# Altium schematic sheet controllers.SchDoc: FHGR_A3_landscape
size A3; Date: 18.07.2017; DrawnBy: G.P. Catregn; Organization: HTW Chur; Address1: Pulvermühlestrasse 57; Address2: 7004 Chur; Address3: Switzerland; DocumentNumber: 1; Revision: V1.0; SheetNumber: 1; SheetTotal: 3; DocumentName: HTW Template
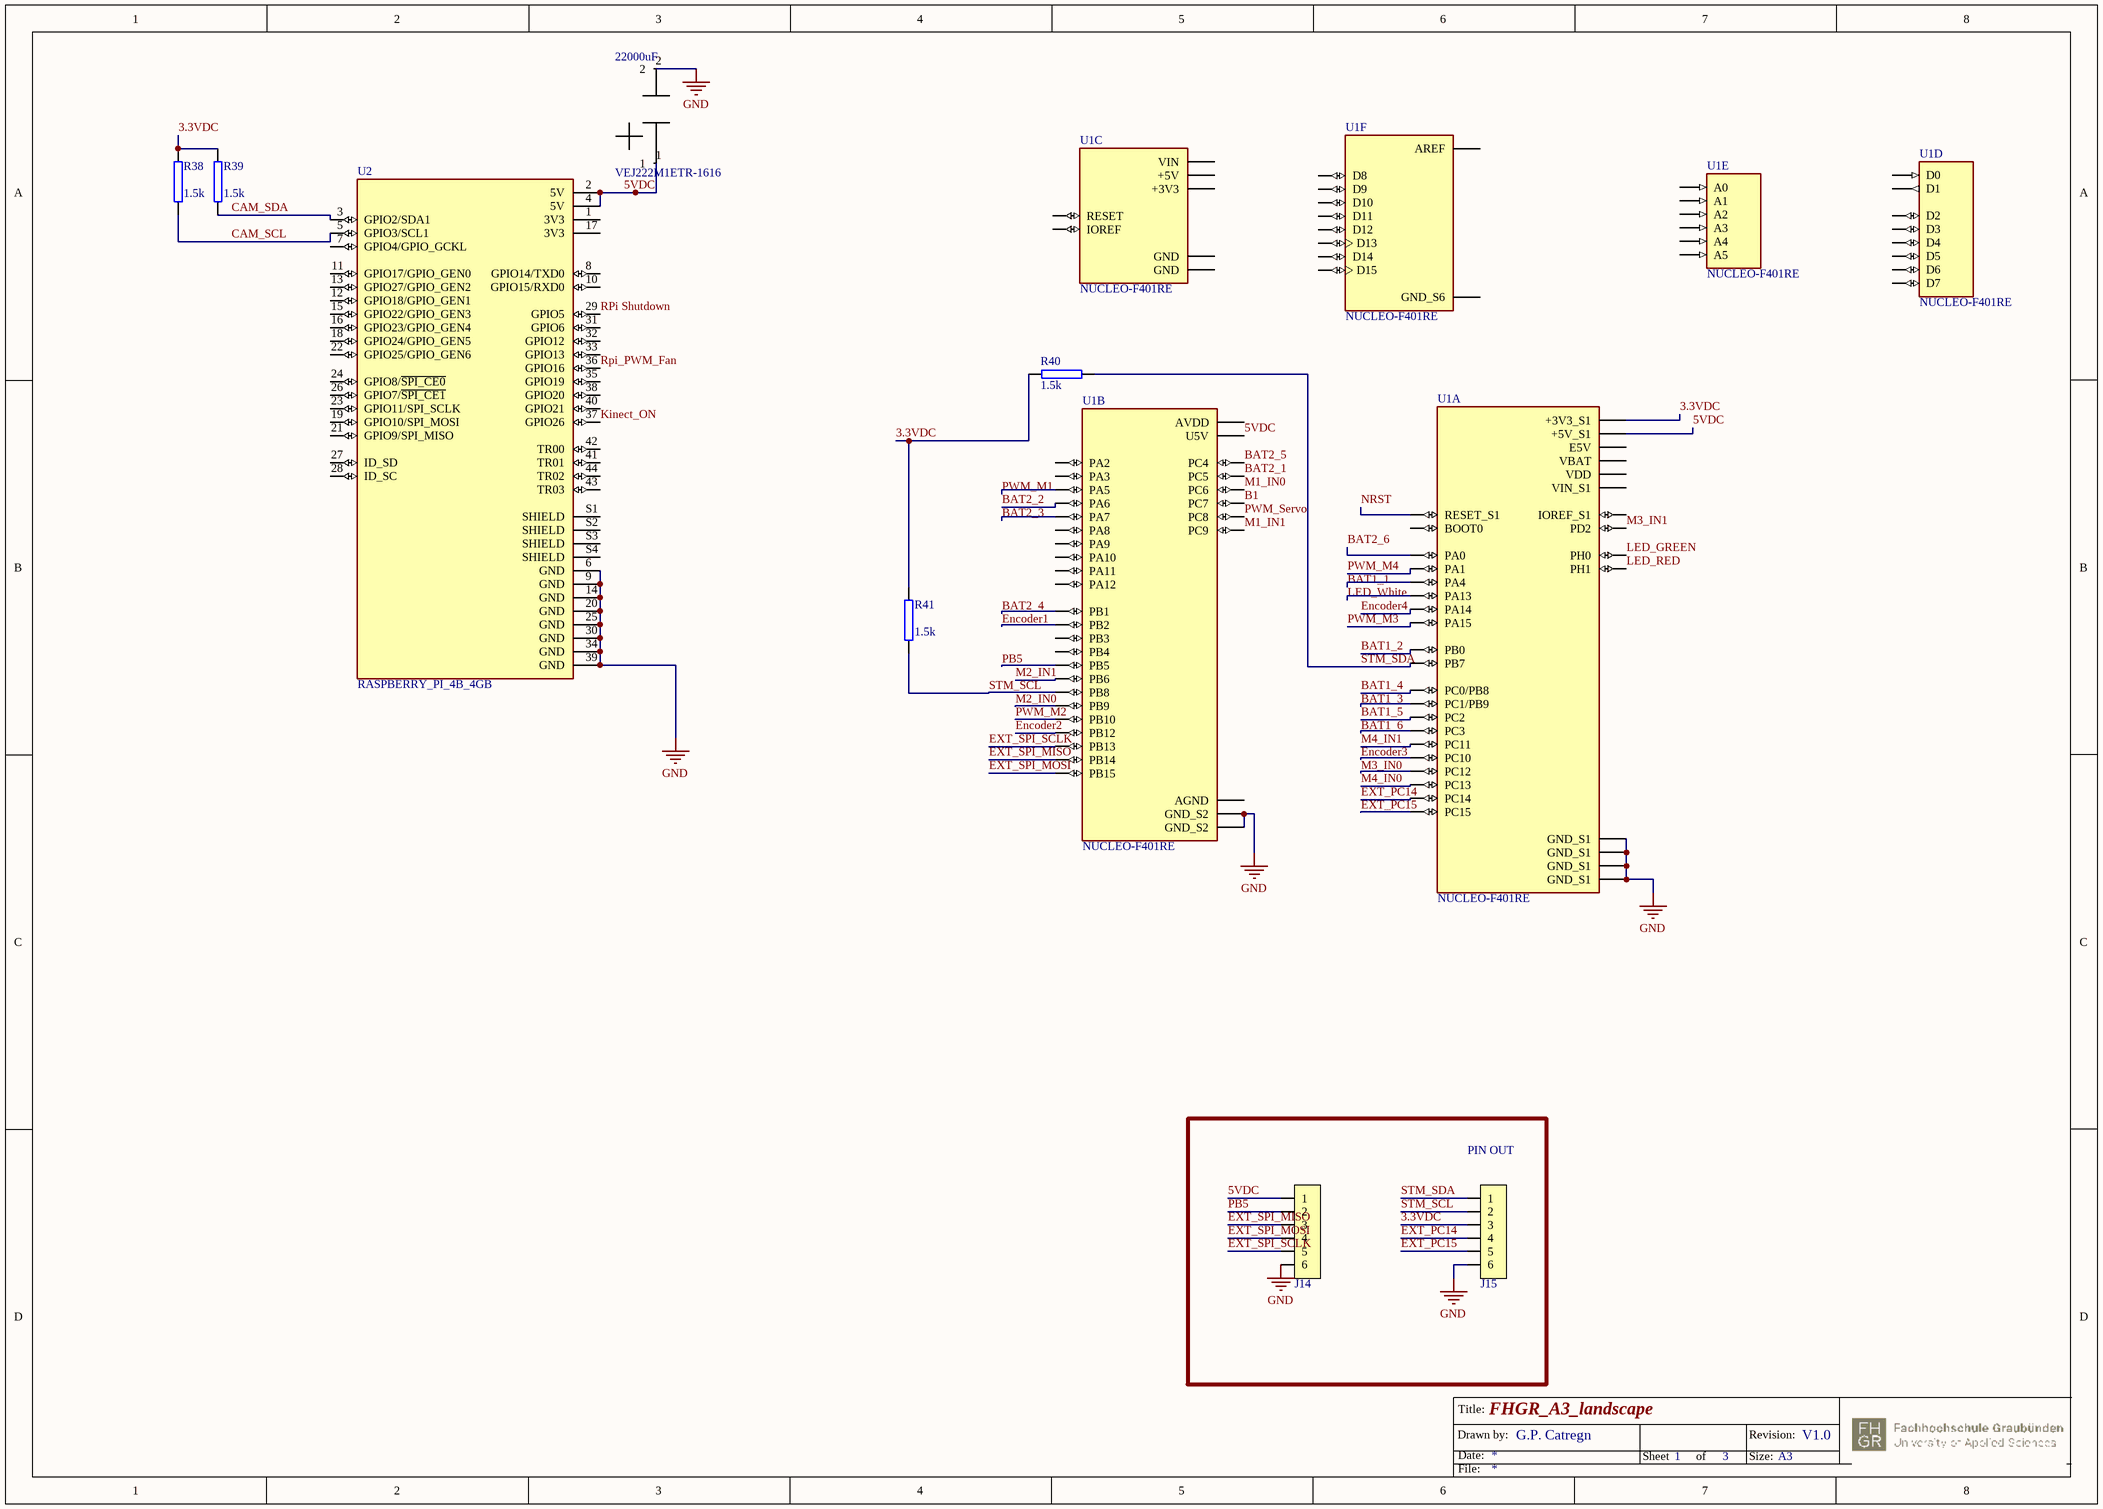
[diagram p0: controllers.SchDoc]

## Parts
22000uF  VEJ222M1ETR-1616  [CAPAE180170X170M]
J14  6Pin_Male  [Header1x6_254]  (value not drawn)
J15  6Pin_Male  [Header1x6_254]  (value not drawn)
R38  value 1.5k  [0805]  (hidden comment: R 1K5 0805)
R39  value 1.5k  [0805]  (hidden comment: R 1K5 0805)
R40  value 1.5k  [0805]  (hidden comment: R 1K5 0805)
R41  value 1.5k  [0805]  (hidden comment: R 1K5 0805)
U1  NUCLEO-F401RE  [ST_NUCLEO-F401RE]  (parts A,B,C,D,E,F of 6)
U2  RASPBERRY_PI_4B_4GB  [MODULE_RASPBERRY_PI_4B_4GB]

## Blocks framed on the sheet
PIN OUT: J14 J15

## Nets
GND: 22000uF.2 J14.6 J15.6 U1.CN7_8(GND_S1) U1.CN7_19(GND_S1) U1.CN7_20(GND_S1) U1.CN7_22(GND_S1) U1.CN10_9(GND_S2) U1.CN10_20(GND_S2) U2.6(GND) U2.9(GND) U2.14(GND) U2.20(GND) U2.25(GND) U2.30(GND) U2.34(GND) U2.39(GND)
3.3VDC: J15.3 R38.2 R39.2 R40.2 R41.2 U1.CN7_16(+3V3_S1)
5VDC: 22000uF.1 J14.1 U1.CN7_18(+5V_S1) U1.CN10_8(U5V) U2.2(5V) U2.4(5V)
B1: U1.CN10_19(PC7)
BAT1_1: U1.CN7_32(PA4)
BAT1_2: U1.CN7_34(PB0)
BAT1_3: U1.CN7_36(PC1/PB9)
BAT1_4: U1.CN7_38(PC0/PB8)
BAT1_5: U1.CN7_35(PC2)
BAT1_6: U1.CN7_37(PC3)
BAT2_1: U1.CN10_6(PC5)
BAT2_2: U1.CN10_13(PA6)
BAT2_3: U1.CN10_15(PA7)
BAT2_4: U1.CN10_24(PB1)
BAT2_5: U1.CN10_34(PC4)
BAT2_6: U1.CN7_28(PA0)
CAM_SCL: R38.1 U2.5(GPIO3/SCL1)
CAM_SDA: R39.1 U2.3(GPIO2/SDA1)
Encoder1: U1.CN10_22(PB2)
Encoder2: U1.CN10_16(PB12)
Encoder3: U1.CN7_1(PC10)
Encoder4: U1.CN7_15(PA14)
EXT_PC14: J15.4 U1.CN7_25(PC14)
EXT_PC15: J15.5 U1.CN7_27(PC15)
EXT_SPI_MISO: J14.3 U1.CN10_28(PB14)
EXT_SPI_MOSI: J14.4 U1.CN10_26(PB15)
EXT_SPI_SCLK: J14.5 U1.CN10_30(PB13)
Kinect_ON: U2.37(GPIO26)
LED_GREEN: U1.CN7_29(PH0)
LED_RED: U1.CN7_31(PH1)
LED_White: U1.CN7_13(PA13)
M1_IN0: U1.CN10_4(PC6)
M1_IN1: U1.CN10_1(PC9)
M2_IN0: U1.CN10_5(PB9)
M2_IN1: U1.CN10_17(PB6)
M3_IN0: U1.CN7_3(PC12)
M3_IN1: U1.CN7_4(PD2)
M4_IN0: U1.CN7_23(PC13)
M4_IN1: U1.CN7_2(PC11)
NRST: U1.CN7_14(RESET_S1)
PB5: J14.2 U1.CN10_29(PB5)
PWM_M1: U1.CN10_11(PA5)
PWM_M2: U1.CN10_25(PB10)
PWM_M3: U1.CN7_17(PA15)
PWM_M4: U1.CN7_30(PA1)
PWM_Servo: U1.CN10_2(PC8)
RPi Shutdown: U2.29(GPIO5)
Rpi_PWM_Fan: U2.36(GPIO16)
STM_SCL: J15.2 R41.1 U1.CN10_3(PB8)
STM_SDA: J15.1 R40.1 U1.CN7_21(PB7)

Not connected (* = marked no-connect by the designer): U1 CN5_1(D8) CN5_2(D9) CN5_3(D10) CN5_4(D11) CN5_5(D12) CN5_6(D13) CN5_7(GND_S6) CN5_8(AREF) CN5_9(D14) CN5_10(D15) CN6_2(IOREF) CN6_3(RESET) CN6_4(+3V3) CN6_5(+5V) CN6_6(GND) CN6_7(GND) CN6_8(VIN) CN7_5(VDD) CN7_6(E5V) CN7_7(BOOT0) CN7_12(IOREF_S1) CN7_24(VIN_S1) CN7_33(VBAT) CN8_1(A0) CN8_2(A1) CN8_3(A2) CN8_4(A3) CN8_5(A4) CN8_6(A5) CN9_1(D0) CN9_2(D1) CN9_3(D2) CN9_4(D3) CN9_5(D4) CN9_6(D5) CN9_7(D6) CN9_8(D7) CN10_7(AVDD) CN10_12(PA12) CN10_14(PA11) CN10_21(PA9) CN10_23(PA8) CN10_27(PB4) CN10_31(PB3) CN10_32(AGND) CN10_33(PA10) CN10_35(PA2) CN10_37(PA3); U2 1(3V3) 7(GPIO4/GPIO_GCKL) 8(GPIO14/TXD0) 10(GPIO15/RXD0) 11(GPIO17/GPIO_GEN0) 12(GPIO18/GPIO_GEN1) 13(GPIO27/GPIO_GEN2) 15(GPIO22/GPIO_GEN3) 16(GPIO23/GPIO_GEN4) 17(3V3) 18(GPIO24/GPIO_GEN5) 19(GPIO10/SPI_MOSI) 21(GPIO9/SPI_MISO) 22(GPIO25/GPIO_GEN6) 23(GPIO11/SPI_SCLK) 24(GPIO8/~{SPI_CE0}) 26(GPIO7/~{SPI_CE1}) 27(ID_SD) 28(ID_SC) 31(GPIO6) 32(GPIO12) 33(GPIO13) 35(GPIO19) 38(GPIO20) 40(GPIO21) 41(TR01) 42(TR00) 43(TR03) 44(TR02) S1(SHIELD) S2(SHIELD) S3(SHIELD) S4(SHIELD)

## Notes on the sheet
- Drawn by:
- Title:
- Date:
- Sheet
- of
- Size:
- Revision:
- A3
- File:

## Library data of the parts
J14 J15 = ArduinoConnector_6: Part ID: ArduinoConnector_6; Price 1pc (CHF): 0.32; Supplier 1: Digi-Key; ComponentLink1Description: Datasheet; ComponentLink1URL: https://katalog.we-online.de/em/datasheet/6130xx11121.pdf; Supplier Part Number 1: 732-5319-ND
R38-R41 = R_1k5_0805: Tolerance: 1%; Power Dissipation: 250mW; Part ID: R_1k5_0805; Price 10pcs (CHF): 0.072; Supplier 1: Digi-Key; Supplier Part Number 1: RNCP0805FTD1K50CT-ND
U1 = NUCLEO-F401RE: STM32 Nucleo-64 development board with STM32F401RET6 MCU, supports Arduino and ST morpho connectivity; Value: *; MP: NUCLEO-F401RE; Package: None; Availability: Unavailable; Price: None
U2 = CMP-052-000000-1: BCM2711 Raspberry Pi 4 Model B 4GB - ARMÂ® CortexÂ®-A72 MPU Embedded Evaluation Board; MP: RASPBERRY PI 4B/4GB; Design Item ID: RASPBERRY_PI_4B_4GB; Source: RASPBERRY_PI_4B_4GB.SchLib; MF: Raspberry Pi; Check_prices: https://www.snapeda.com/parts/RASPBERRY%20PI%204B/4GB/Raspberry+Pi/view-part/?ref=eda; SnapEDA_Link: https://www.snapeda.com/parts/RASPBERRY%20PI%204B/4GB/Raspberry+Pi/view-part/?ref=snap; Value: *; Purchase-URL: https://pricing.snapeda.com/search/part/RASPBERRY PI 4B/4GB/?ref=eda; Price: None; Availability: In Stock; Package: None; Component Type: Standard; Pin Count: 48